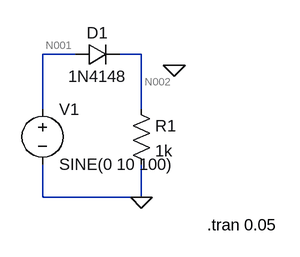
[diagram p0: schematic Draft3.asc]
Draft3.asc, the LTspice schematic file:
Version 4.1
SHEET 1 880 680
WIRE 112 32 64 32
WIRE 208 32 176 32
WIRE 64 112 64 32
WIRE 208 112 208 32
WIRE 64 240 64 192
WIRE 208 240 208 192
WIRE 208 240 64 240
FLAG 208 240 0
FLAG 256 48 0
SYMBOL voltage 64 96 R0
WINDOW 123 0 0 Left 0
WINDOW 39 0 0 Left 0
SYMATTR InstName V1
SYMATTR Value SINE(0 10 100)
SYMBOL res 192 96 R0
SYMATTR InstName R1
SYMATTR Value 1k
SYMBOL diode 112 48 R270
WINDOW 0 32 32 VTop 2
WINDOW 3 0 32 VBottom 2
SYMATTR InstName D1
SYMATTR Value 1N4148
TEXT 304 280 Left 2 !.tran 0.05

The netlist it stands for:
* Draft3.asc
V1 N001 0 SINE(0 10 100)
R1 N002 0 1k
D1 N001 N002 1N4148
.model D D
.lib standard.dio
.tran 0.05
.backanno
.end

* Results of the author's LTspice run, read from the files saved beside the schematic
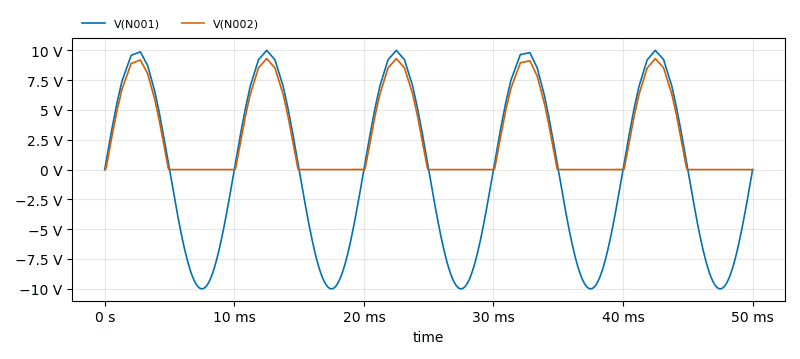
[diagram p1: Transient Analysis of Draft3.asc, plotted from the saved traces]
* Transient Analysis, 1 run:
*   V(N001): min -10 V, max 10 V, average -34.64 mV, rms 7.044 V, last 0 V
*   V(N002): min -46.43 µV, max 9.309 V, average 2.827 V, rms 4.537 V, last 35.83 µV